# EAGLE design Mega_Base_Shield (EAGLE 9.1.3)
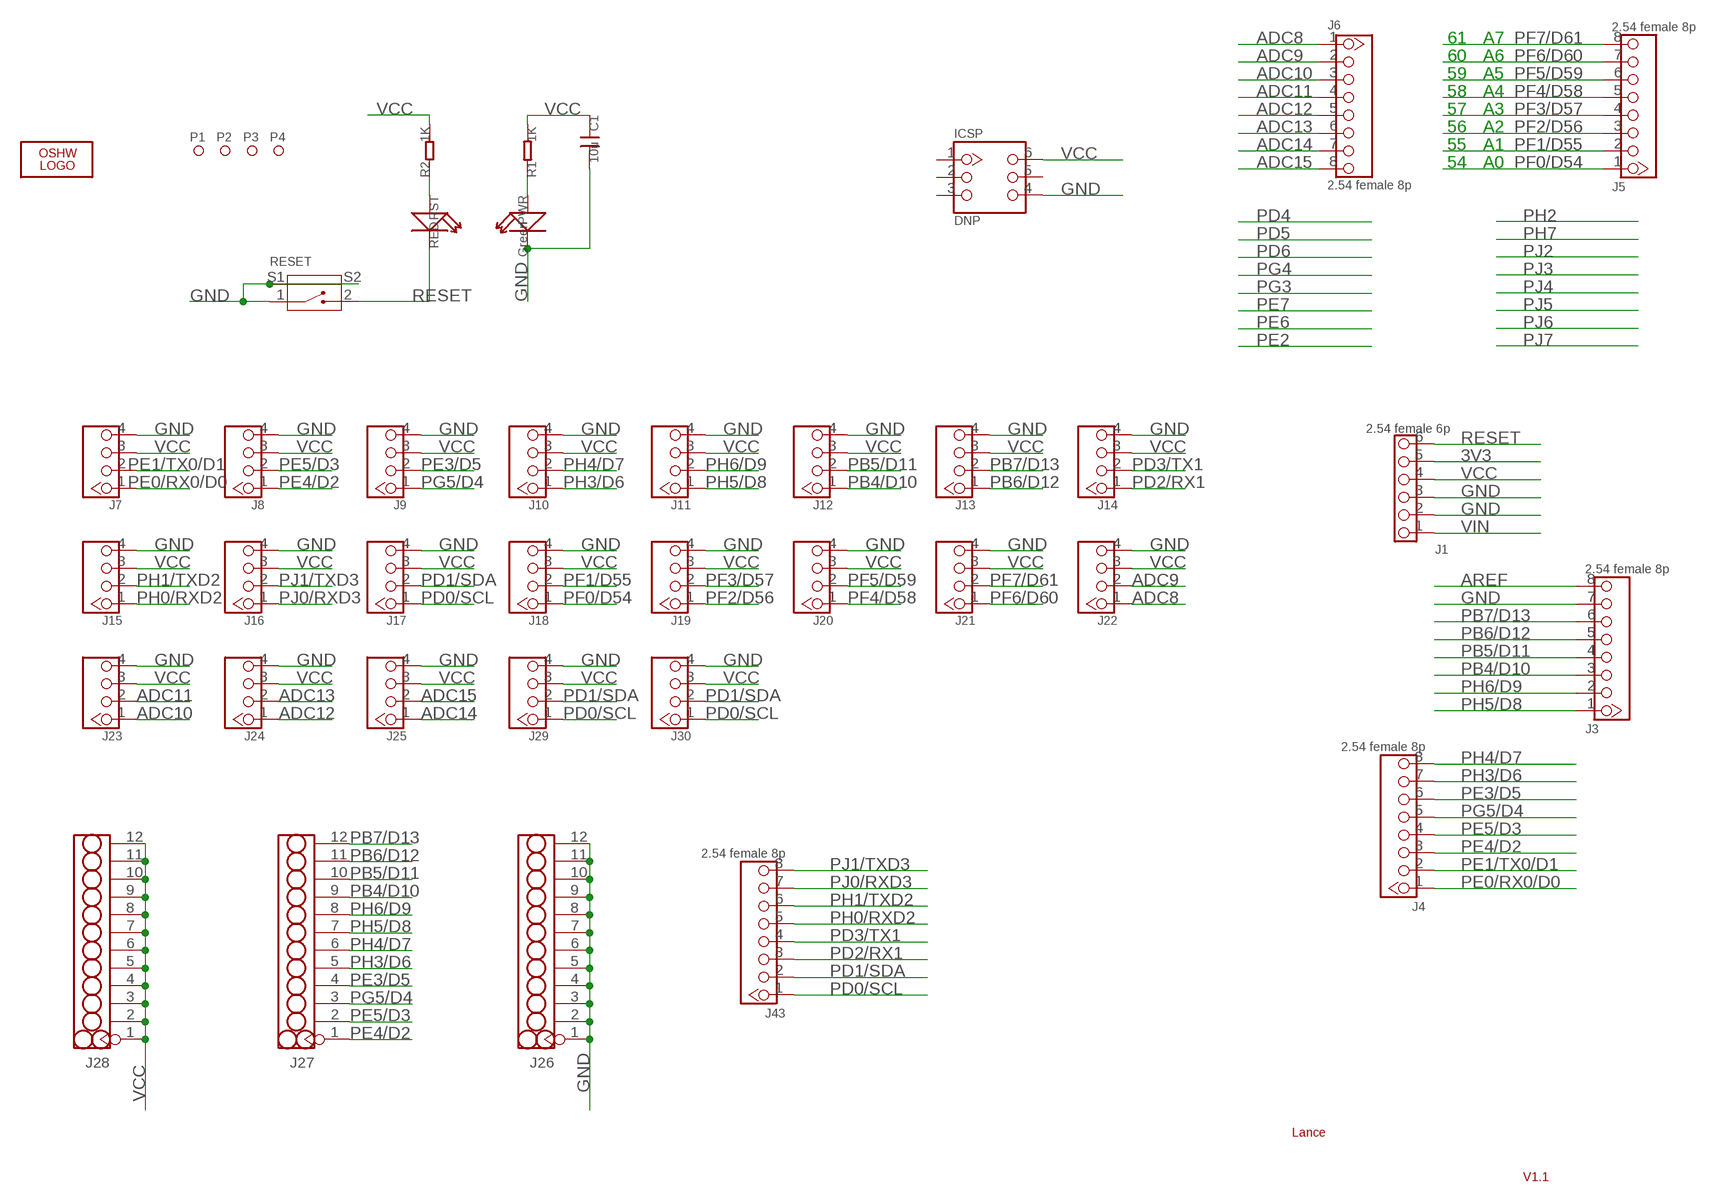
[diagram p0: schematic, sheet 1]

## Parts
C1  10u  C-0805  [0805]
ICSP  DNP  HEADER-2X3P'60/35'  [2X3P-2.54-LEADED-60/35]
J1  2.54 female 6p  HEADER-6P-LEADED-2.54  [6P-2.54-LEADED]
J3  2.54 female 8p  HEADER-8P-2.54-LEADED  [8P-2.54-LEADED]
J4  2.54 female 8p  HEADER-8P-2.54-LEADED  [8P-2.54-LEADED]
J5  2.54 female 8p  HEADER-8P-2.54-LEADED  [8P-2.54-LEADED]
J6  2.54 female 8p  HEADER-8P-2.54-LEADED  [8P-2.54-LEADED]
J7  TWIG-2.0-LEADED'90D'  [4P-LEADED-2.0-90]
J8  TWIG-2.0-LEADED  [4P-LEADED-2.0]
J9  TWIG-2.0-LEADED  [4P-LEADED-2.0]
J10  TWIG-2.0-LEADED  [4P-LEADED-2.0]
J11  TWIG-2.0-LEADED  [4P-LEADED-2.0]
J12  TWIG-2.0-LEADED  [4P-LEADED-2.0]
J13  TWIG-2.0-LEADED  [4P-LEADED-2.0]
J14  TWIG-2.0-LEADED'90D'  [4P-LEADED-2.0-90]
J15  TWIG-2.0-LEADED'90D'  [4P-LEADED-2.0-90]
J16  TWIG-2.0-LEADED'90D'  [4P-LEADED-2.0-90]
J17  TWIG-2.0-LEADED'90D'  [4P-LEADED-2.0-90]
J18  TWIG-2.0-LEADED  [4P-LEADED-2.0]
J19  TWIG-2.0-LEADED  [4P-LEADED-2.0]
J20  TWIG-2.0-LEADED  [4P-LEADED-2.0]
J21  TWIG-2.0-LEADED  [4P-LEADED-2.0]
J22  TWIG-2.0-LEADED  [4P-LEADED-2.0]
J23  TWIG-2.0-LEADED  [4P-LEADED-2.0]
J24  TWIG-2.0-LEADED  [4P-LEADED-2.0]
J25  TWIG-2.0-LEADED  [4P-LEADED-2.0]
J26  HEADER-12P-2.54  [12P-2.54-LEADED]
J27  HEADER-12P-2.54  [12P-2.54-LEADED]
J28  HEADER-12P-2.54  [12P-2.54-LEADED]
J29  TWIG-2.0-LEADED  [4P-LEADED-2.0]
J30  TWIG-2.0-LEADED  [4P-LEADED-2.0]
J43  2.54 female 8p  HEADER-8P-2.54-LEADED  [8P-2.54-LEADED]
LOGO1  LOGO-OSHW-FILLX0200-NT  [OSHW_FILLX200_NOTEXT]
P1  PAD-MARK'ANNULAR'  [ROUND-MARK-1.0]
P2  PAD-MARK'ANNULAR'  [ROUND-MARK-1.0]
P3  PAD-MARK'ANNULAR'  [ROUND-MARK-1.0]
P4  PAD-MARK'ANNULAR'  [ROUND-MARK-1.0]
PWR  Green  LED-0603  [D0603]
R1  1K  R-0402  [0402]
R2  1K  R-0402  [0402]
RESET  BUTTON-2+2P'TS-1188E'  [4P-SMD-L7.0*W3.5*H3.5MM-90D]
RST  RED  LED-0603  [D0603]

## Nets
3V3: J1.5
ADC8: J6.1 J22.1
ADC9: J6.2 J22.2
ADC10: J6.3 J23.1
ADC11: J6.4 J23.2
ADC12: J6.5 J24.1
ADC13: J6.6 J24.2
ADC14: J6.7 J25.1
ADC15: J6.8 J25.2
AREF: J3.8
GND: C1.2 ICSP.4 J1.2 J1.3 J3.7 J7.4 J8.4 J9.4 J10.4 J11.4 J12.4 J13.4 J14.4 J15.4 J16.4 J17.4 J18.4 J19.4 J20.4 J21.4 J22.4 J23.4 J24.4 J25.4 J26.1 J26.2 J26.3 J26.4 J26.5 J26.6 J26.7 J26.8 J26.9 J26.10 J26.11 J26.12 J29.4 J30.4 PWR.- RESET.1 RESET.S1 RESET.S2
N$1: PWR.+ R1.1
N$38: R2.1 RST.+
PB4/D10: J3.3 J12.1 J27.9
PB5/D11: J3.4 J12.2 J27.10
PB6/D12: J3.5 J13.1 J27.11
PB7/D13: J3.6 J13.2 J27.12
PD0/SCL: J17.1 J29.1 J30.1 J43.1
PD1/SDA: J17.2 J29.2 J30.2 J43.2
PD2/RX1: J14.1 J43.3
PD3/TX1: J14.2 J43.4
PE0/RX0/D0: J4.1 J7.1
PE1/TX0/D1: J4.2 J7.2
PE3/D5: J4.6 J9.2 J27.4
PE4/D2: J4.3 J8.1 J27.1
PE5/D3: J4.4 J8.2 J27.2
PF0/D54: J5.1 J18.1
PF1/D55: J5.2 J18.2
PF2/D56: J5.3 J19.1
PF3/D57: J5.4 J19.2
PF4/D58: J5.5 J20.1
PF5/D59: J5.6 J20.2
PF6/D60: J5.7 J21.1
PF7/D61: J5.8 J21.2
PG5/D4: J4.5 J9.1 J27.3
PH0/RXD2: J15.1 J43.5
PH1/TXD2: J15.2 J43.6
PH3/D6: J4.7 J10.1 J27.5
PH4/D7: J4.8 J10.2 J27.6
PH5/D8: J3.1 J11.1 J27.7
PH6/D9: J3.2 J11.2 J27.8
PJ0/RXD3: J16.1 J43.7
PJ1/TXD3: J16.2 J43.8
RESET: J1.6 RESET.2 RST.-
VCC: C1.1 ICSP.6 J1.4 J7.3 J8.3 J9.3 J10.3 J11.3 J12.3 J13.3 J14.3 J15.3 J16.3 J17.3 J18.3 J19.3 J20.3 J21.3 J22.3 J23.3 J24.3 J25.3 J28.1 J28.2 J28.3 J28.4 J28.5 J28.6 J28.7 J28.8 J28.9 J28.10 J28.11 J28.12 J29.3 J30.3 R1.2 R2.2
VIN: J1.1
Unconnected: ICSP.1 ICSP.2 ICSP.3 ICSP.5

## Notes on the sheet
- 61 | A7
- 60 | A6
- 59 | A5
- 58 | A4
- 57 | A3
- 56 | A2
- 55 | A1
- 54 | A0
- Lance
- V1.1

## Library data of the parts
C1 = Discrete:C*: Ceramic Capacitors
ICSP = Connector:HEADER-2X3P
J1 = Connector:HEADER-6P
J3-J6 J43 = Connector:HEADER-8P
J7-J25 J29 J30 = Connector:TWIG-2.0-LEADED
J26-J28 = Connector:HEADER-12P
LOGO1 = Logo:LOGO-OSHW-FILL
P1-P4 = Discrete-new:PAD-MARK; PARTNO: DNP
PWR RST = Discrete:LED*
R1 R2 = Discrete:R*
RESET = Discrete-new:BUTTON-2+2P: 4P-SMD-L4.5*W3.8*H1.8MM-90D:311020035;4P-SMD-L7.0*W3.5*H3.5MM-90D:311020023

## Net classes
0 default: width 0.152 mm, drill 0.305 mm, clearance 0.152 mm

## Board
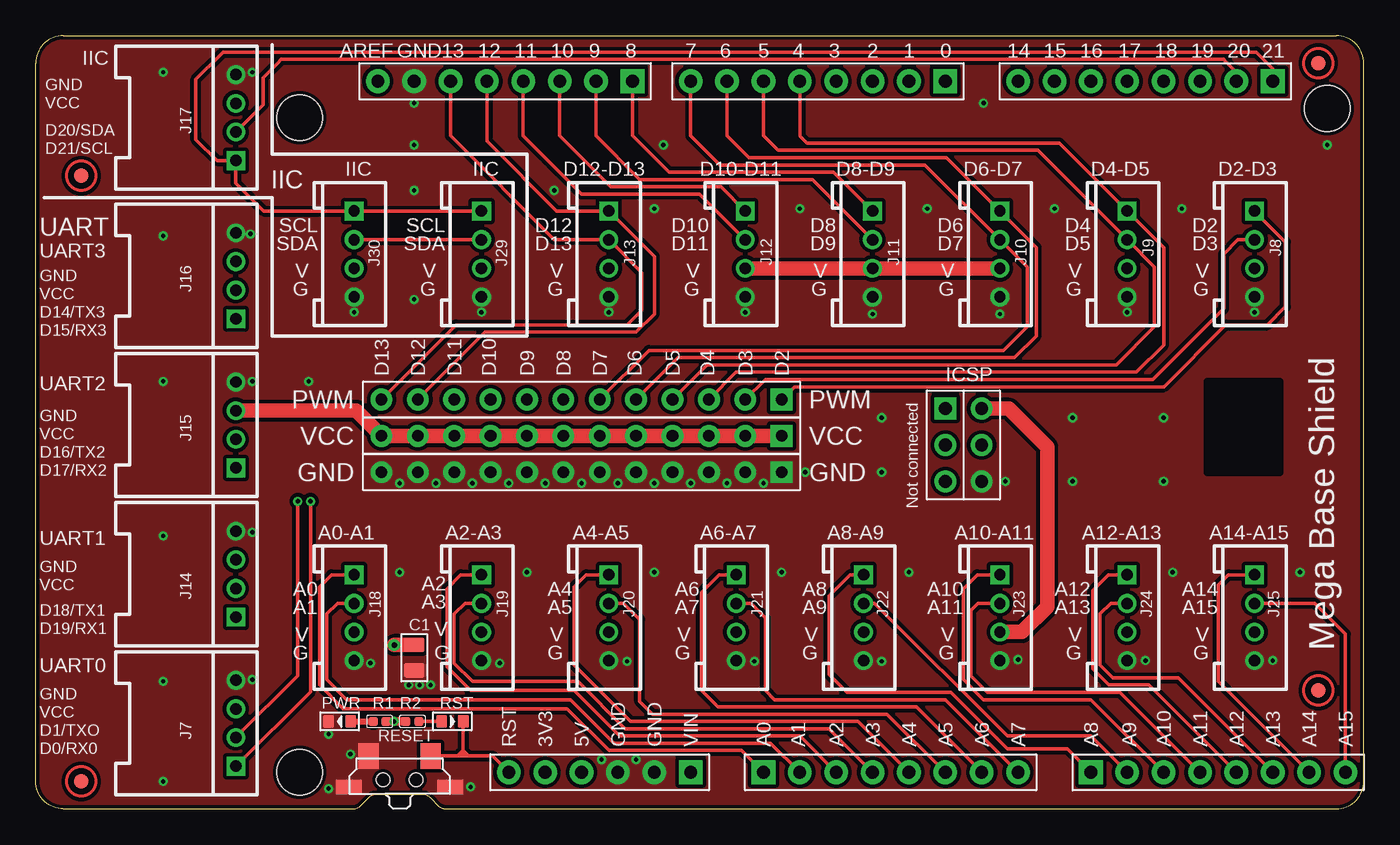
[diagram p1: board, top side]
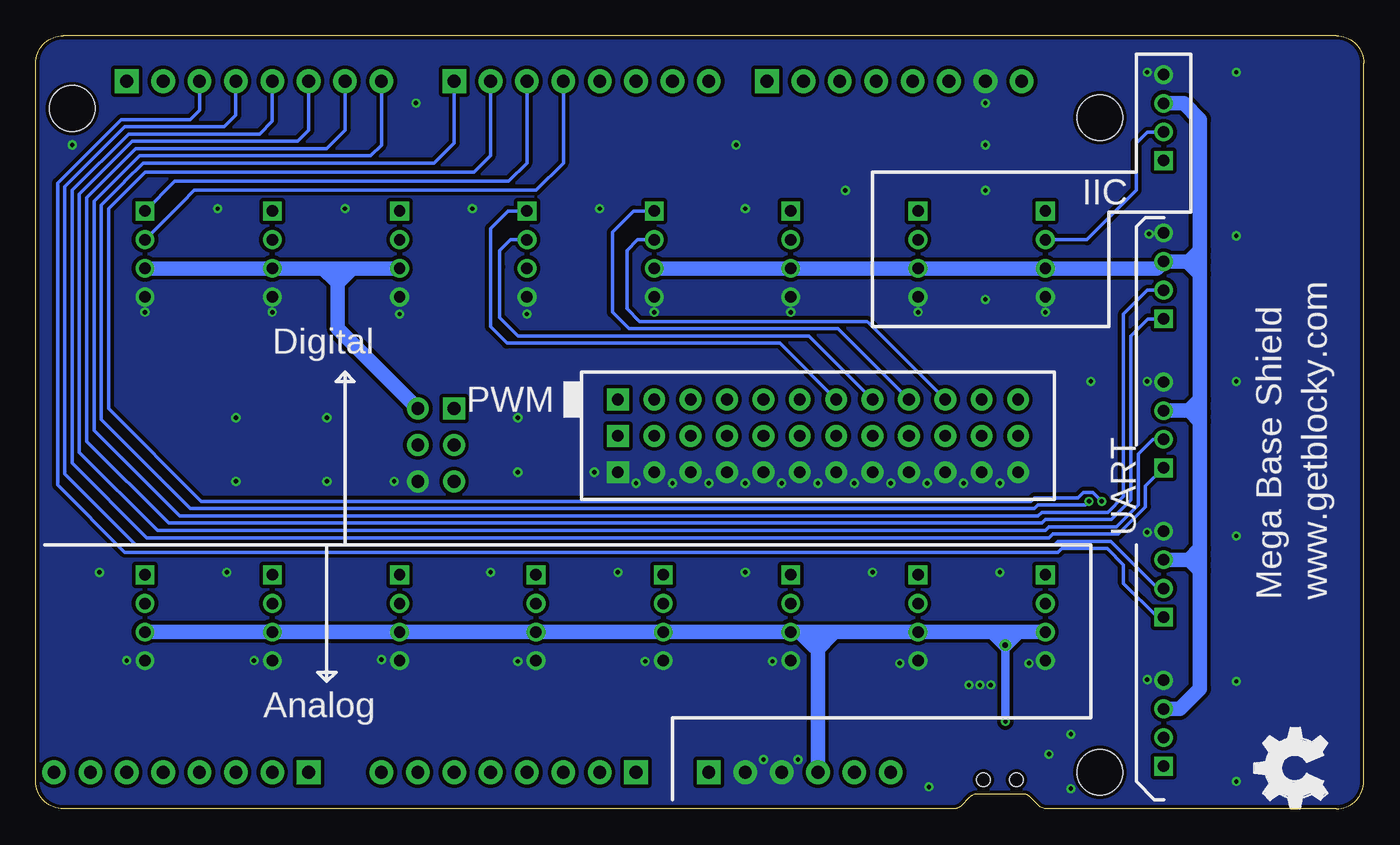
[diagram p2: board, bottom side, seen from below]

Size 92.71 x 53.98 mm. Coordinates in mm from the lower left corner, seen from the top.
Outline: 29.97,0 90.81,0 arc90 92.71,1.91 92.71,52.07 arc90 90.81,53.98 1.91,53.98 arc90 0,52.07 0,1.91 arc90 1.91,0 22.14,0 arc45 22.72,0.24 23.31,0.83 arc-45 23.76,1.02 27.01,1.02 arc-45 27.52,0.81 28.14,0.19 arc45 28.58,0 29.97,0
Copper layers (1*16): Top 0.035mm / dielectric 1.5mm / Bottom 0.035mm
Design rules "SeeedStudio_rule_no_angle_090911": minimum track width 6mil, minimum drill 12mil, track to track 6mil, track to pad 6mil, pad to pad 6mil, via to via 6mil, smd to smd 0mil, copper to edge 10mil, drill to drill 10mil, minimum pad ring 10mil, minimum via ring 6mil, stop-mask expansion 2mil, vias tented up to drill 100mil, thermal gap 10mil
Holes 3.2 mm at 90.17,48.9 18.41,48.26 18.41,2.54
tRestrict: area 81.8,23.5 to 86.9,29.8

### Footprints (pad centres in the part's own frame; a part is rotated, then mirrored left to right if it is on the bottom)
0805 = smd 1.016 x 1.397: 1 -0.889,0; 2 0.889,0
2X3P-2.54-LEADED-60/35 = drill 0.889 pad 1.524 square: 1 -1.27,2.54 | drill 0.889 pad 1.524: 2 -1.27,0; 3 -1.27,-2.54; 4 1.27,-2.54; 5 1.27,0; 6 1.27,2.54
6P-2.54-LEADED = drill 0.889 pad 1.651 square: 1 0,6.35 | drill 0.889 pad 1.651: 2 0,3.81; 3 0,1.27; 4 0,-1.27; 5 0,-3.81; 6 0,-6.35
8P-2.54-LEADED = drill 0.889 pad 1.651 square: 1 0,8.89 | drill 0.889 pad 1.651: 2 0,6.35; 3 0,3.81; 4 0,1.27; 5 0,-1.27; 6 0,-3.81; 7 0,-6.35; 8 0,-8.89
4P-LEADED-2.0-90 = drill 0.8 pad 1.27 square: 1 -3,0 | drill 0.8 pad 1.27: 2 -1,0; 3 1,0; 4 3,0
4P-LEADED-2.0 = drill 0.8 pad 1.27 square: 1 -3,0 | drill 0.8 pad 1.27: 2 -1,0; 3 1,0; 4 3,0
12P-2.54-LEADED = drill 0.813 pad 1.524 square: 1 0,13.97 | drill 0.813 pad 1.524: 2 0,11.43; 3 0,8.89; 4 0,6.35; 5 0,3.81; 6 0,1.27; 7 0,-1.27; 8 0,-3.81; 9 0,-6.35; 10 0,-8.89; 11 0,-11.43; 12 0,-13.97
ROUND-MARK-1.0 = smd 1.016 x 1.016: P$1 0,0
D0603 = smd 0.762 x 0.889: + -0.762,0; - 0.762,0
0402 = smd 0.635 x 0.635: 1 -0.445,0; 2 0.445,0
4P-SMD-L7.0*W3.5*H3.5MM-90D = smd 1.397 x 1.778: 1 -2.159,1.651; 2 2.159,1.651 | smd 1.778 x 1.016: S1 -3.556,-0.508; S2 3.556,-0.508 | hole 0.95: -1.15,0; 1.15,0

### Placement (x,y rotation side)
C1  26.42,10.54 270 top
ICSP  64.77,25.4 0 top
J1  39.37,2.54 270 top
J3  32.77,50.8 270 top
J4  54.61,50.8 270 top
J5  59.69,2.54 90 top
J6  82.55,2.54 90 top
J7  13.97,5.97 90 top
J8  85.09,38.73 270 top
J9  76.2,38.73 270 top
J10  67.31,38.73 270 top
J11  58.42,38.73 270 top
J12  49.53,38.73 270 top
J13  40.01,38.73 270 top
J14  13.97,16.38 90 top
J15  13.97,26.8 90 top
J16  13.97,37.21 90 top
J17  13.97,48.26 90 top
J18  22.23,13.34 270 top
J19  31.11,13.34 270 top
J20  40.01,13.34 270 top
J21  48.9,13.34 270 top
J22  57.78,13.34 270 top
J23  67.31,13.34 270 top
J24  76.2,13.34 270 top
J25  85.09,13.34 270 top
J26  38.1,23.5 270 top
J27  38.1,28.57 270 top
J28  38.1,26.04 270 top
J29  31.11,38.73 270 top
J30  22.23,38.73 270 top
J43  77.47,50.8 270 top
LOGO1  2.54,0 90 bottom
P1  3.17,44.2 0 top
P2  89.53,52.07 0 top
P3  89.53,8.25 0 top
P4  3.17,1.91 0 top
PWR  21.21,6.1 180 top
R1  24,6.1 0 top
R2  26.29,6.1 180 top
RESET  25.4,2.03 0 top
RST  29.08,6.1 0 top

### Tracks (layer width: path | path; a pad name or v marks a point on that pad's centre or on a via)
ADC8
  Top 0.254: J22.1 56.85,16.34 55.37,14.86 55.37,9.4 56.64,8.13 63.88,8.13 67.82,4.19 72.01,4.19 J6.1
ADC9
  Top 0.254: J22.2 58.56,14.34 67.82,5.08 73.66,5.08 J6.2
ADC10
  Top 0.254: J23.1 65.74,16.34 64.9,15.49 64.77,15.37 64.77,9.02 66.17,7.62 73.66,7.62 J6.3
ADC11
  Top 0.254: J6.4 75.69,8.13 66.42,8.13 65.28,9.27 65.28,13.84 65.79,14.35 67.29,14.35 J23.2
ADC12
  Top 0.254: J6.5 77.72,8.64 74.93,8.64 73.91,9.65 73.79,9.78 73.79,15.24 74.74,16.19 | 74.74,16.19 74.8,16.26 | J24.1 74.88,16.34 74.74,16.19
ADC13
  Top 0.254: J6.6 79.76,9.14 75.18,9.14 74.3,10.03 74.3,13.59 75.06,14.35 76.18,14.35 J24.2
ADC14
  Top 0.254: J6.7 82.55,8.89 82.55,15.62 83.26,16.34 J25.1
ADC15
  Top 0.254: J25.2 89.3,14.34 91.44,12.19 J6.8
GND  (via drill 0.3 pad 0.64)
  other vias: 20.45,5.21 21.97,3.81 20.45,1.4 30.35,1.52 26.04,8.64 26.8,8.64 27.56,8.64 15.11,9.02 15.11,19.3 15.11,29.85 14.99,40.13 15.11,51.44 26.42,49.28 85.09,34.67 76.2,34.67 67.31,34.54 58.42,34.54 49.53,34.67 40.01,34.67 31.11,34.67 22.23,34.67 67.69,22.86 53.72,23.5 25.4,22.73 27.94,22.73 30.48,22.73 33.02,22.73 35.56,22.73 38.1,22.73 40.64,22.73 43.18,22.73 45.72,22.73 48.26,22.73 50.8,22.73 23.37,10.16 32.38,10.16 41.27,10.29 50.16,10.29 59.05,10.29 68.58,10.41 77.47,10.35 86.36,10.35 39.5,3.43 41.91,3.43 72.39,22.86 78.74,22.86 78.74,27.3 72.39,27.3 19.05,29.85 26.42,46.36 26.42,43.18 26.42,35.56 25.4,16.51 34.29,16.51 43.18,16.51 52.07,16.51 60.96,16.51 79.38,16.51 88.27,16.51 8.89,8.89 8.89,19.05 8.89,29.85 8.89,40.01 8.89,51.44 8.89,1.91 66.17,49.28 43.81,46.36 90.17,46.36 59.05,23.5 59.05,27.3 80.01,41.91 71.12,41.91 62.23,41.91 53.34,41.91 43.18,41.91 36.2,43.18
  pour Bottom (isolate 0.254, rank 6, no thermals): 0,53.98 92.71,53.98 92.71,-1.9 0,-1.9
  pour Top (isolate 0.254, rank 6, no thermals): 0,53.98 92.71,53.98 92.71,-1.9 0,-1.9
N$1
  Top 0.406: PWR.+ R1.1
N$38
  Top 0.254: R2.1 RST.+
PB4/D10
  Top 0.254: J12.1 47.83,43.43 40.13,43.43 36.58,46.99 J3.3
  Bottom 0.254: J27.9 36.7,33.53 51.31,33.53 52.45,34.67 52.45,38.81 52.45,40.26 50.98,41.73 J12.1
PB5/D11
  Top 0.254: J12.2 46.34,42.93 38.1,42.93 34.04,46.99 J3.4
  Bottom 0.254: J27.10 34.54,33.91 34.67,34.04 50.55,34.04 51.44,34.93 51.44,37.83 51.44,38.99 50.69,39.73 J12.2
PB6/D12
  Top 0.254: J27.11 31.37,33.27 41.91,33.27 43.18,34.54 43.18,38.56 J13.1 36.37,41.73 31.56,46.55 31.5,46.61 J3.5
PB7/D13
  Top 0.254: J27.12 29.34,33.78 41.27,33.78 42.29,34.8 42.29,37.45 J13.2 39.99,39.75 38.1,39.75 36.2,39.75 28.96,46.99 J3.6
PD0/SCL
  Top 0.254: J29.1 J30.1 15.92,41.73 13.97,43.69 J17.1 12.65,45.26 11.18,46.74 11.18,47.12 11.18,50.93 12.83,52.58 13.08,52.83 85.22,52.83 85.47,52.58 86.36,51.69 J43.1
PD1/SDA
  Top 0.254: J30.2 J29.2 | J43.2 83.82,50.93 83.82,51.44 83.19,52.07 83.06,52.2 82.93,52.32 17.14,52.32 16.89,52.07 15.88,51.05 15.88,49.17 J17.2
  Bottom 0.254: J30.2 19.32,39.73 15.88,43.18 15.88,45.36 15.88,46.48 15.11,47.24 13.99,47.24 J17.2
PD2/RX1
  Bottom 0.254: J14.1 14.4,13.38 16.76,15.75 16.76,17.02 17.91,18.16 21.08,18.16 21.34,17.91 86.49,17.91 91.19,22.61 91.19,43.69 86.74,48.13 81.92,48.13 81.28,48.77 J43.3
PD3/TX1
  Bottom 0.254: J14.2 14.37,15.38 17.65,18.67 21.34,18.67 21.59,18.41 85.72,18.41 90.68,23.37 90.68,43.43 86.49,47.62 79.54,47.62 78.74,48.43 J43.4
PE0/RX0/D0  (via drill 0.3 pad 0.64)
  Top 0.254: v19.18,21.46 19.18,8.18 J7.1
  Bottom 0.254: v19.18,21.46 19.43,21.21 22.73,21.21 22.99,20.95 81.92,20.95 88.14,27.18 88.14,42.16 86.55,43.75 86.49,43.82 85.22,45.09 64.9,45.09 63.5,46.48 J4.1
PE1/TX0/D1  (via drill 0.3 pad 0.64)
  Top 0.254: v18.29,21.46 18.29,9.29 J7.2
  Bottom 0.254: v18.29,21.46 18.92,22.1 19.56,22.1 19.94,21.72 22.99,21.72 23.24,21.46 81.15,21.46 87.63,27.94 87.63,41.91 86.3,43.24 86.23,43.31 85.09,44.45 62.1,44.45 60.96,45.59 J4.2
PE3/D5
  Top 0.254: J27.4 46.86,30.99 75.44,30.99 78.11,33.66 78.11,37.83 J9.2 69.96,45.97 51.82,45.97 50.93,46.86 50.8,46.99 J4.6
PE4/D2
  Top 0.254: J27.1 52.96,29.46 78.74,29.46 83.06,33.78 85.98,33.78 87.25,35.05 87.25,39.58 J8.1
  Bottom 0.254: J8.1 83.01,43.82 59.69,43.82 58.42,45.09 J4.3
PE5/D3
  Top 0.254: J27.2 50.93,29.97 77.98,29.97 82.93,34.93 82.93,38.73 83.93,39.73 J8.2
  Bottom 0.254: J8.2 82.67,42.16 82.53,42.29 81.64,43.18 57.78,43.18 55.88,45.09 J4.4
PF0/D54
  Top 0.254: J18.1 20.65,16.34 19.81,15.49 19.81,8.64 21.46,6.99 37.08,6.99 40.01,4.06 49.28,4.06 J5.1
PF1/D55
  Top 0.254: J18.2 21.07,14.34 20.32,13.59 20.32,9.02 21.72,7.62 37.34,7.62 40.39,4.57 51.31,4.57 J5.2
PF2/D56
  Top 0.254: J19.1 29.67,16.34 28.7,15.37 28.7,9.91 30.35,8.25 37.59,8.25 40.77,5.08 53.34,5.08 J5.3
PF3/D57
  Top 0.254: J19.2 29.96,14.34 29.21,13.59 29.21,10.16 30.48,8.89 37.85,8.89 41.15,5.59 55.37,5.59 J5.4
PF4/D58
  Top 0.254: J20.1 38.43,16.34 37.59,15.49 37.59,10.03 40.51,7.11 41.53,6.1 57.4,6.1 J5.5
PF5/D59
  Top 0.254: J20.2 41.04,14.34 42.16,13.21 42.16,7.49 43.05,6.6 59.44,6.6 J5.6
PF6/D60
  Top 0.254: J21.1 47.7,16.34 46.48,15.11 46.48,8.25 47.62,7.11 61.47,7.11 J5.7
PF7/D61
  Top 0.254: J21.2 49.93,14.34 50.93,13.34 50.93,8.25 51.56,7.62 63.5,7.62 J5.8
PG5/D4
  Top 0.254: J27.3 48.9,30.48 76.83,30.48 78.74,32.39 78.74,39.2 J9.1 71.45,46.48 53.85,46.48 53.4,46.93 53.34,46.99 J4.5
PH0/RXD2
  Bottom 0.254: J15.1 15.24,22.53 15.24,21.08 17.14,19.18 21.72,19.18 21.97,18.92 84.96,18.92 90.17,24.13 90.17,43.18 86.23,47.12 77.1,47.12 76.2,48.02 J43.5
PH1/TXD2
  Bottom 0.254: J15.2 14.73,25.8 15.75,24.78 15.75,21.21 17.27,19.68 21.97,19.68 22.23,19.43 84.2,19.43 89.66,24.89 89.66,42.93 85.98,46.61 74.42,46.61 73.66,47.37 J43.6
PH3/D6
  Top 0.254: J27.5 44.83,31.5 68.33,31.5 69.85,33.02 69.85,39.2 J10.1 63.58,45.47 49.78,45.47 48.39,46.86 48.26,46.99 J4.7
PH4/D7
  Top 0.254: J27.6 42.8,32 67.56,32 69.22,33.66 69.22,37.83 J10.2 62.09,44.96 47.75,44.96 45.85,46.86 45.72,46.99 J4.8
PH5/D8
  Top 0.254: J11.1 55.7,44.45 44.2,44.45 41.72,46.93 41.66,46.99 J3.1
  Bottom 0.254: 60.96,39.12 60.96,33.66 59.82,32.51 40.77,32.51 J27.7 | 60.96,39.12 60.96,39.2 | J11.1 59.74,41.73 60.96,40.51 60.96,39.12
PH6/D9
  Top 0.254: J11.2 54.21,43.94 42.16,43.94 39.12,46.99 J3.2
  Bottom 0.254: J27.8 38.73,33.02 59.05,33.02 60.33,34.29 60.33,37.83 60.33,38.99 59.58,39.73 J11.2
PJ0/RXD3
  Bottom 0.254: J16.1 15.06,34.21 16.26,33.02 16.26,21.57 17.63,20.19 22.23,20.19 22.48,19.94 83.44,19.94 89.15,25.65 89.15,42.67 87.06,44.77 87,44.83 85.72,46.1 72.39,46.1 71.12,47.37 J43.7
PJ1/TXD3
  Bottom 0.254: J16.2 15.1,36.21 16.76,34.54 16.76,21.8 17.87,20.7 22.48,20.7 22.73,20.45 82.68,20.45 88.65,26.42 88.65,42.42 86.81,44.26 86.74,44.32 85.47,45.59 69.34,45.59 68.58,46.36 J43.8
RESET
  Top 0.254: RST.- 29.84,4.06 | 29.84,4.06 29.84,3.68 | RESET.2 29.46,3.68 | 29.46,3.68 29.84,3.68 | 29.84,3.68 30.23,3.68 | 30.23,3.68 31.88,3.68 J1.6 | 29.84,4.06 29.46,3.68 | 29.84,4.06 30.23,3.68
VCC  (via drill 0.3 pad 0.64, 0.38 pad 0.81)
  Top 0.61: R2.2 v25.02,6.1 R1.2
  Top 1.016: J12.3 J11.3 J10.3 | J23.3 68.85,12.34 70.61,14.1 70.61,25.27 67.94,27.94 ICSP.6 | C1.1 v25.02,11.43 | J15.3 22.37,27.8 J28.12 J28.11 J28.10 J28.9 J28.8 J28.7 J28.6 J28.5 J28.4 J28.3 J28.2 J28.1
  Bottom 0.61: v25.02,6.1 v25.02,11.43
  Bottom 1.016: J7.3 12.84,6.97 11.43,8.38 11.43,16.64 | 11.43,16.64 11.43,17.4 | 11.43,17.4 11.43,18.16 | 11.43,18.16 11.43,27.05 | 11.43,27.05 11.43,27.69 | 11.43,27.69 11.43,28.57 | 11.43,28.57 11.43,37.34 | 11.43,37.34 11.43,38.23 | 11.43,38.23 11.43,38.99 | 11.43,38.99 11.43,48.13 12.56,49.26 J17.3 | J14.3 12.21,17.38 | 12.18,17.38 11.45,17.38 11.43,17.4 | 12.21,17.38 11.43,18.16 | 12.21,17.38 12.18,17.38 | 12.18,17.38 11.43,16.64 | J15.3 12.21,27.8 | 12.18,27.8 11.54,27.8 11.43,27.69 | 12.21,27.8 11.43,28.57 | 12.21,27.8 12.18,27.8 | 12.18,27.8 11.43,27.05 | 12.3,38.21 J16.3 14.45,37.73 | 12.21,38.21 11.45,38.21 11.43,38.23 | 12.3,38.21 12.21,38.21 | 12.21,38.21 11.43,38.99 | 12.3,38.21 11.43,37.34 | 14.46,37.72 14.45,37.73 | 14.45,37.73 J30.3 J29.3 J13.3 J12.3 | ICSP.6 71.63,33.53 71.63,36.7 | 71.63,36.7 71.63,36.83 | 71.63,36.83 71.63,37.73 | J10.3 71.63,37.73 | 71.63,37.73 J9.3 J8.3 | 71.63,36.7 70.61,37.72 | 71.63,36.83 71.75,36.83 72.64,37.72 | J25.3 J24.3 J23.3 J22.3 J21.3 J20.3 38.23,12.34 | J1.4 38.1,11.18 | 38.1,11.18 38.1,11.3 | 38.1,11.3 38.1,12.21 38.23,12.34 | 38.23,12.34 J19.3 25.87,12.34 | 38.1,11.18 37.08,12.19 | 38.1,11.3 38.35,11.3 39.24,12.19 | J18.3 24.11,12.34 | 24.11,12.34 25.02,12.34 | 25.02,12.34 25.87,12.34 | v25.02,11.43 25.02,12.34 | 24.11,12.34 v25.02,11.43 | 25.87,12.34 25.87,12.28 v25.02,11.43

### Text on the board
tPlace: IIC | AREF | GND | 13 | 12 | 11 | 10 | 9 | 8 | 7 | 6 | 5 | 4 | 3 | 2 | 1 | 0 | 14 | 15 | 16 | 17 | 18 | 19 | 20 | 21 | GND | VCC | D20/SDA | D21/SCL | IIC | IIC | IIC | D12-D13 | D10-D11 | D8-D9 | D6-D7 | D4-D5 | D2-D3 | SCL | SCL | D12 | D10 | D8 | D6 | D4 | D2 | UART | SDA | SDA | D13 | D11 | D9 | D7 | D5 | D3 | UART3 | V | V | V | V | V | V | V | V | GND | G | G | G | G | G | G | G | G | VCC | D14/TX3 | D15/RX3 | D13 | D12 | D11 | D10 | D9 | D8 | D7 | D6 | D5 | D4 | D3 | D2 | UART2 | PWM | PWM | GND | VCC | VCC | VCC | D16/TX2 | GND | D17/RX2 | GND | Not connected | UART1 | A0-A1 | A2-A3 | A4-A5 | A6-A7 | A8-A9 | A10-A11 | A12-A13 | A14-A15 | GND | A0 | A4 | A6 | A8 | A10 | A12 | A14 | VCC | A1 | A2 | A5 | A7 | A9 | A11 | A13 | A15 | D18/TX1 | A3 | V | V | V | V | V | V | V | D19/RX1 | G | V | G | G | G | G | G | G | G | Mega Base Shield | UART0 | GND | VCC | RST | D1/TXO | D0/RX0 | RST | 3V3 | 5V | GND | GND | VIN | A0 | A1 | A2 | A3 | A4 | A5 | A6 | A7 | A8 | A9 | A10 | A11 | A12 | A13 | A14 | A15
bPlace: IIC | Digital | PWM | UART | www.getblocky.com | Mega Base Shield | Analog
tValues: Micro USB